# Altium schematic sheet Sheet1.SchDoc
size A; SheetNumber: 1; SheetTotal: 1
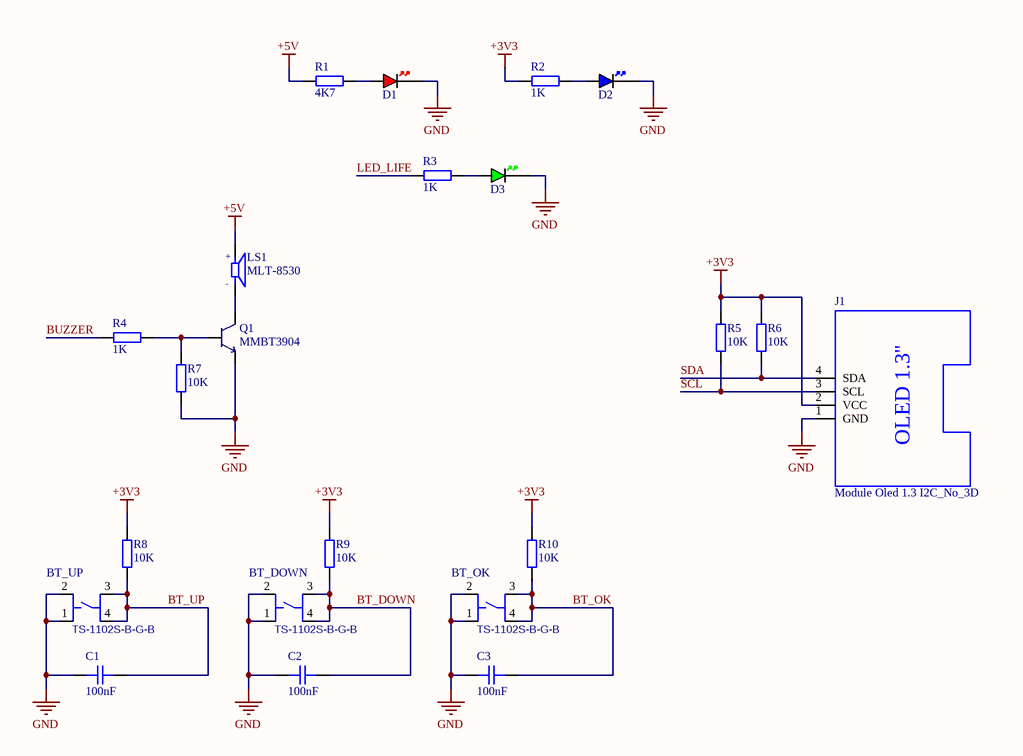
[diagram p0: Sheet1.SchDoc]

## Parts
BT_DOWN  TS-1102S-B-G-B  [SW-SMD_4P-L6.0-W6.4-P4.50-LS8.6]
BT_OK  TS-1102S-B-G-B  [SW-SMD_4P-L6.0-W6.4-P4.50-LS8.6]
BT_UP  TS-1102S-B-G-B  [SW-SMD_4P-L6.0-W6.4-P4.50-LS8.6]
C1  100nF  [CAP_0603]
C2  100nF  [CAP_0603]
C3  100nF  [CAP_0603]
D1  RED  [LED_0603_RED]  (value not drawn)
D2  BLUE  [LED_0603_BLUE]  (value not drawn)
D3  GREEN  [LED_0603_GREEN]  (value not drawn)
J1  Module Oled 1.3 I2C_No_3D  [Module Oled 1.3 - No 3D]
LS1  MLT-8530  [BUZ-SMD_4P-L8.5-W8.5-P8.50-BR]
Q1  MMBT3904  [SOT-23-3_L2.9-W1.3-P1.90-LS2.4-BR]
R1  4K7  [RES_0603]
R2  1K  [RES_0603]
R3  1K  [RES_0603]
R4  1K  [RES_0603]
R5  10K  [RES_0603]
R6  10K  [RES_0603]
R7  10K  [RES_0603]
R8  10K  [RES_0603]
R9  10K  [RES_0603]
R10  10K  [RES_0603]

## Nets
+3V3: J1.2(VCC) R2.1 R5.2 R6.2 R8.2 R9.2 R10.2
+5V: LS1.1 R1.1
GND: BT_DOWN.1 BT_DOWN.2 BT_OK.1 BT_OK.2 BT_UP.1 BT_UP.2 C1.1 C2.1 C3.1 D1.K D2.K D3.K J1.1(GND) Q1.2 R7.1
BT_DOWN: BT_DOWN.3 BT_DOWN.4 C2.2 R9.1
BT_OK: BT_OK.3 BT_OK.4 C3.2 R10.1
BT_UP: BT_UP.3 BT_UP.4 C1.2 R8.1
BUZZER: R4.1
LED_LIFE: R3.1
SCL: J1.3(SCL) R5.1
SDA: J1.4(SDA) R6.1
NetD1_A: D1.A R1.2
NetD2_A: D2.A R2.2
NetD3_A: D3.A R3.2
NetLS1_2: LS1.2 Q1.3
NetQ1_1: Q1.1 R4.2 R7.2

## Notes on the sheet
- (in symbol BUZ_MLT-8530) +; -
- (in symbol Module Oled 1.3 I2C_No_3D) OLED 1.3''

## Library data of the parts
BT_DOWN BT_OK BT_UP = TS-1102S-B-G-B: Botton SMD TACTILE SWITCHES ROHS; Manufacturer: XKB Connectivity; Manufacturer Part Number: TS-1102S-C-F-B; LCSC Part Number: C381064; Package: SMD-4_6.0x6.0x4.5P-2; Assembly Type: SMT Assembly
C1-C3 = CAP_0603: Capacitor SMD 0603; Manufacturer: *; Manufacturer Part Number: *; Distributor Link: *; LCSC: *; Rating: *; Dielectric: *
D1 = LED_0603_RED: LED 0603 RED SMD
D2 = LED_0603_BLUE: LED 0603 BLUE SMD
D3 = LED_0603_GREEN: LED 0603 GREEN SMD
J1 = Module Oled 1.3 I2C_No_3D: Module Oled 1.3 I2C; Manufacturer: EPCB.vn; Assembly Type: Hand Soldering; Package: Through P=2.54; LCSC Part Number: N/A; Manufacturer Part Number: N/A
LS1 = BUZ_MLT-8530: BUZZERS MAGNETIC NO 2700HZ 3.6V 2.5 ~ 4.5V 8.5MM X 8.5MM 8.5*8.5*3MM ROHS; Manufacturer: Jiangsu Huaneng Elec; Manufacturer Part Number: MLT-8530; LCSC Part Number: C94599; Package: SMD-4_8.7x8.7x3.0; Assembly Type: SMT Assembly
Q1 = MMBT3904: MMBT3904 TRANSISTORS (NPN/PNP) NPN 200MA 40V SOT-23(SOT-23-3) ROHS; Manufacturer: Changjiang Electronics Tech (CJ); Manufacturer Part Number: MMBT3904; LCSC Part Number: C20526; Package: SOT-23-3; Assembly Type: SMT Assembly
R1-R10 = RES_0603: Resistor SMD 0603; Manufacturer: *; Manufacturer Part Number: *; Distributor Link: *; LCSC: *